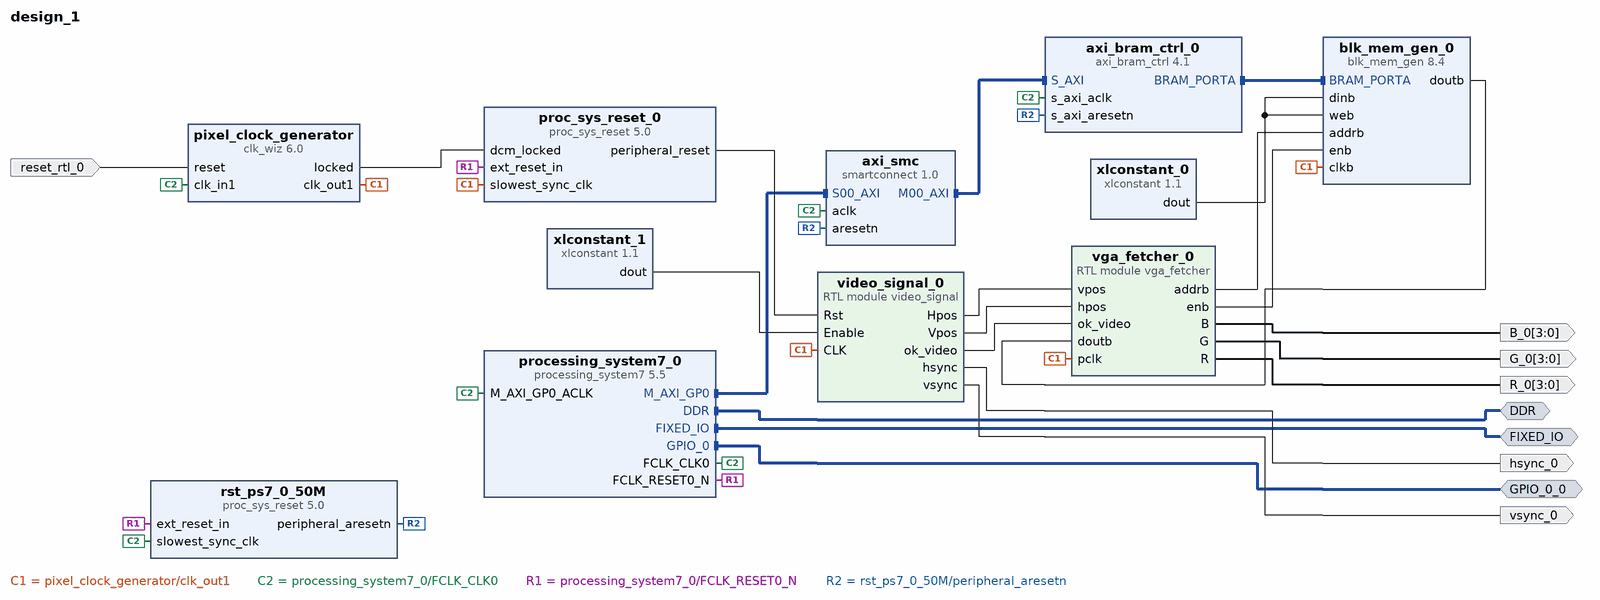
[diagram p0: block diagram of the top level]
# Vivado block design design_1, xc7z010iclg225-1L, Vivado 2026.1
create_bd_design design_1

create_bd_intf_port -mode Master -vlnv xilinx.com:interface:ddrx_rtl:1.0 DDR
create_bd_intf_port -mode Master -vlnv xilinx.com:display_processing_system7:fixedio_rtl:1.0 FIXED_IO
create_bd_intf_port -mode Master -vlnv xilinx.com:interface:gpio_rtl:1.0 GPIO_0_0
create_bd_port -dir I -type rst reset_rtl_0
set_property -dict {CONFIG.POLARITY ACTIVE_HIGH} [get_bd_ports reset_rtl_0]
create_bd_port -dir O -from 3 -to 0 R_0
create_bd_port -dir O -from 3 -to 0 G_0
create_bd_port -dir O -from 3 -to 0 B_0
create_bd_port -dir O hsync_0
create_bd_port -dir O vsync_0

create_bd_cell -type ip -vlnv xilinx.com:ip:processing_system7:5.5 processing_system7_0
set_property -dict [list \
  CONFIG.PCW_GPIO_EMIO_GPIO_ENABLE 1 \
  CONFIG.PCW_GPIO_EMIO_GPIO_IO 3 \
  CONFIG.PCW_GPIO_EMIO_GPIO_WIDTH 3 \
  CONFIG.PCW_GPIO_MIO_GPIO_ENABLE 1 \
  CONFIG.PCW_GPIO_MIO_GPIO_IO MIO \
  CONFIG.PCW_I2C_RESET_ENABLE 1 \
  CONFIG.PCW_USB_RESET_ENABLE 1 \
] [get_bd_cells processing_system7_0]
# 94 more settings of processing_system7_0 are not shown: defaults, MIO pin electricals, DDR timing, and values the tool derives
create_bd_cell -type module -reference video_signal video_signal_0
create_bd_cell -type ip -vlnv xilinx.com:ip:clk_wiz:6.0 pixel_clock_generator
set_property -dict [list \
  CONFIG.CLKOUT1_JITTER 251.929 \
  CONFIG.CLKOUT1_PHASE_ERROR 245.344 \
  CONFIG.CLKOUT1_REQUESTED_OUT_FREQ 74.250 \
  CONFIG.MMCM_CLKFBOUT_MULT_F 37.125 \
  CONFIG.MMCM_CLKOUT0_DIVIDE_F 12.500 \
  CONFIG.MMCM_DIVCLK_DIVIDE 2 \
] [get_bd_cells pixel_clock_generator]
create_bd_cell -type ip -vlnv xilinx.com:ip:blk_mem_gen:8.4 blk_mem_gen_0
set_property -dict [list \
  CONFIG.Assume_Synchronous_Clk false \
  CONFIG.Memory_Type True_Dual_Port_RAM \
  CONFIG.Operating_Mode_B WRITE_FIRST \
  CONFIG.Read_Width_A 32 \
  CONFIG.Write_Depth_A 16384 \
  CONFIG.Write_Width_B 8 \
  CONFIG.use_bram_block Stand_Alone \
] [get_bd_cells blk_mem_gen_0]
create_bd_cell -type ip -vlnv xilinx.com:ip:axi_bram_ctrl:4.1 axi_bram_ctrl_0
set_property -dict {CONFIG.PROTOCOL AXI4 CONFIG.SINGLE_PORT_BRAM 1} [get_bd_cells axi_bram_ctrl_0]
create_bd_cell -type ip -vlnv xilinx.com:ip:smartconnect:1.0 axi_smc
set_property -dict {CONFIG.NUM_SI 1} [get_bd_cells axi_smc]
create_bd_cell -type ip -vlnv xilinx.com:ip:proc_sys_reset:5.0 rst_ps7_0_50M
create_bd_cell -type module -reference vga_fetcher vga_fetcher_0
create_bd_cell -type ip -vlnv xilinx.com:ip:xlconstant:1.1 xlconstant_0
set_property -dict {CONFIG.CONST_VAL 0 CONFIG.CONST_WIDTH 8} [get_bd_cells xlconstant_0]
create_bd_cell -type ip -vlnv xilinx.com:ip:xlconstant:1.1 xlconstant_1
create_bd_cell -type ip -vlnv xilinx.com:ip:proc_sys_reset:5.0 proc_sys_reset_0

# ---- connections ----

connect_bd_intf_net [get_bd_intf_pins blk_mem_gen_0/BRAM_PORTA] [get_bd_intf_pins axi_bram_ctrl_0/BRAM_PORTA]
connect_bd_intf_net [get_bd_intf_pins axi_smc/M00_AXI] [get_bd_intf_pins axi_bram_ctrl_0/S_AXI]
connect_bd_intf_net [get_bd_intf_ports DDR] [get_bd_intf_pins processing_system7_0/DDR]
connect_bd_intf_net [get_bd_intf_ports FIXED_IO] [get_bd_intf_pins processing_system7_0/FIXED_IO]
connect_bd_intf_net [get_bd_intf_ports GPIO_0_0] [get_bd_intf_pins processing_system7_0/GPIO_0]
connect_bd_intf_net [get_bd_intf_pins processing_system7_0/M_AXI_GP0] [get_bd_intf_pins axi_smc/S00_AXI]
connect_bd_net [get_bd_pins blk_mem_gen_0/doutb] [get_bd_pins vga_fetcher_0/doutb]
connect_bd_net -net clk_wiz_0_clk_out1 [get_bd_pins pixel_clock_generator/clk_out1] \
  [get_bd_pins video_signal_0/CLK] [get_bd_pins vga_fetcher_0/pclk] [get_bd_pins blk_mem_gen_0/clkb] \
  [get_bd_pins proc_sys_reset_0/slowest_sync_clk]
connect_bd_net [get_bd_pins pixel_clock_generator/locked] [get_bd_pins proc_sys_reset_0/dcm_locked]
connect_bd_net [get_bd_pins proc_sys_reset_0/peripheral_reset] [get_bd_pins video_signal_0/Rst]
connect_bd_net [get_bd_pins processing_system7_0/FCLK_CLK0] \
  [get_bd_pins pixel_clock_generator/clk_in1] [get_bd_pins processing_system7_0/M_AXI_GP0_ACLK] [get_bd_pins axi_smc/aclk] \
  [get_bd_pins axi_bram_ctrl_0/s_axi_aclk] [get_bd_pins rst_ps7_0_50M/slowest_sync_clk]
connect_bd_net [get_bd_pins processing_system7_0/FCLK_RESET0_N] [get_bd_pins proc_sys_reset_0/ext_reset_in] [get_bd_pins rst_ps7_0_50M/ext_reset_in]
connect_bd_net -net reset_rtl_0_1 [get_bd_ports reset_rtl_0] [get_bd_pins pixel_clock_generator/reset]
connect_bd_net [get_bd_pins rst_ps7_0_50M/peripheral_aresetn] [get_bd_pins axi_bram_ctrl_0/s_axi_aresetn] [get_bd_pins axi_smc/aresetn]
connect_bd_net [get_bd_pins vga_fetcher_0/B] [get_bd_ports B_0]
connect_bd_net [get_bd_pins vga_fetcher_0/G] [get_bd_ports G_0]
connect_bd_net [get_bd_pins vga_fetcher_0/R] [get_bd_ports R_0]
connect_bd_net [get_bd_pins vga_fetcher_0/addrb] [get_bd_pins blk_mem_gen_0/addrb]
connect_bd_net [get_bd_pins vga_fetcher_0/enb] [get_bd_pins blk_mem_gen_0/enb]
connect_bd_net [get_bd_pins video_signal_0/Hpos] [get_bd_pins vga_fetcher_0/vpos]
connect_bd_net [get_bd_pins video_signal_0/Vpos] [get_bd_pins vga_fetcher_0/hpos]
connect_bd_net [get_bd_pins video_signal_0/hsync] [get_bd_ports hsync_0]
connect_bd_net [get_bd_pins video_signal_0/ok_video] [get_bd_pins vga_fetcher_0/ok_video]
connect_bd_net [get_bd_pins video_signal_0/vsync] [get_bd_ports vsync_0]
connect_bd_net [get_bd_pins xlconstant_0/dout] [get_bd_pins blk_mem_gen_0/dinb] [get_bd_pins blk_mem_gen_0/web]
connect_bd_net [get_bd_pins xlconstant_1/dout] [get_bd_pins video_signal_0/Enable]
set_property HDL_ATTRIBUTE.BMM_INFO_PROCESSOR {arm > design_1 axi_bram_ctrl_0} [get_bd_cells processing_system7_0]
set_property HDL_ATTRIBUTE.KEEP_HIERARCHY yes [get_bd_cells processing_system7_0]
set_property HDL_ATTRIBUTE.BMM_INFO_ADDRESS_SPACE {byte  0x40000000 32 > design_1 blk_mem_gen_0} [get_bd_cells axi_bram_ctrl_0]
set_property HDL_ATTRIBUTE.KEEP_HIERARCHY yes [get_bd_cells axi_bram_ctrl_0]

# ---- address map ----
assign_bd_address -offset 0x40000000 -range 64K -target_address_space [get_bd_addr_spaces processing_system7_0/Data] [get_bd_addr_segs axi_bram_ctrl_0/S_AXI/Mem0]

validate_bd_design
save_bd_design
